# EAGLE schematic followLineSensor (EAGLE 7.7.0)
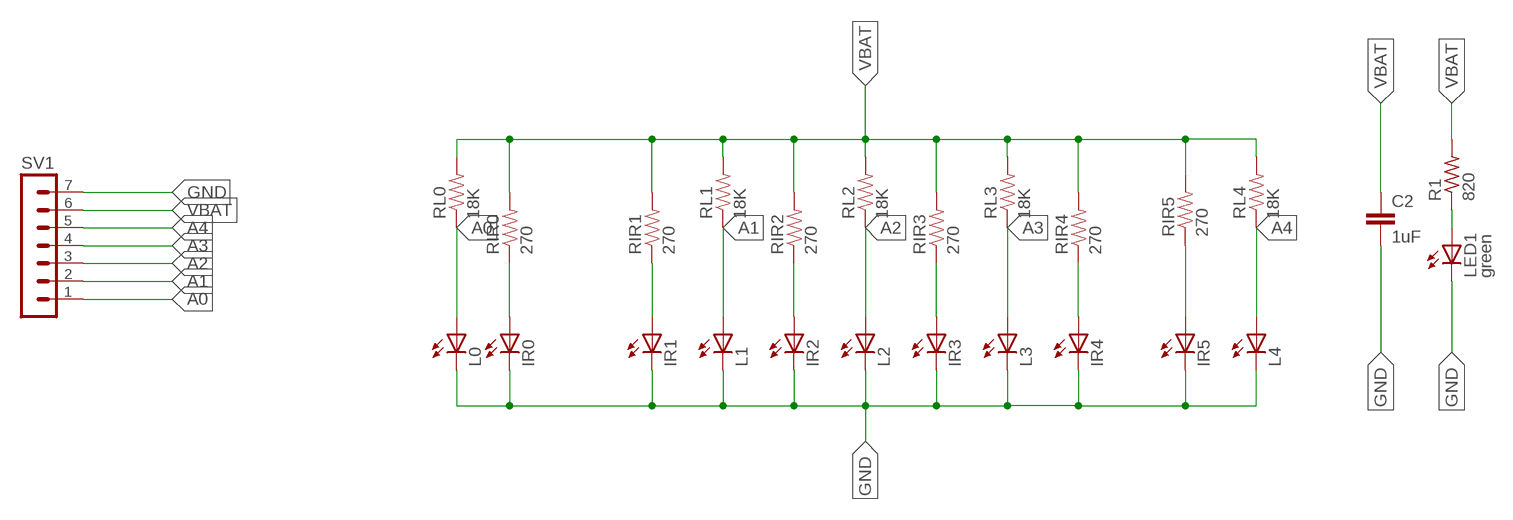
[diagram p0: schematic, sheet 1]

## Parts
C2  1uF  C-EUC1206  [C1206]
IR0  LED5MM  [LED5MM]
IR1  LED5MM  [LED5MM]
IR2  LED5MM  [LED5MM]
IR3  LED5MM  [LED5MM]
IR4  LED5MM  [LED5MM]
IR5  LED5MM  [LED5MM]
L0  LED5MM  [LED5MM]
L1  LED5MM  [LED5MM]
L2  LED5MM  [LED5MM]
L3  LED5MM  [LED5MM]
L4  LED5MM  [LED5MM]
LED1  green  LEDSML0805  [SML0805]
R1  820  R-US_R0805  [R0805]
RIR0  270  RESISTOR1206  [1206]
RIR1  270  RESISTOR1206  [1206]
RIR2  270  RESISTOR1206  [1206]
RIR3  270  RESISTOR1206  [1206]
RIR4  270  RESISTOR1206  [1206]
RIR5  270  RESISTOR1206  [1206]
RL0  18K  RESISTOR1206  [1206]
RL1  18K  RESISTOR1206  [1206]
RL2  18K  RESISTOR1206  [1206]
RL3  18K  RESISTOR1206  [1206]
RL4  18K  RESISTOR1206  [1206]
SV1  MA07-1  [MA07-1]

## Nets
A0: L0.A RL0.1 SV1.1
A1: L1.A RL1.1 SV1.2
A2: L2.A RL2.1 SV1.3
A3: L3.A RL3.1 SV1.4
A4: L4.A RL4.1 SV1.5
GND: C2.2 IR0.K(C) IR1.K(C) IR2.K(C) IR3.K(C) IR4.K(C) IR5.K(C) L0.K(C) L1.K(C) L2.K(C) L3.K(C) L4.K(C) LED1.C SV1.7
N$1: IR1.A RIR1.1
N$2: LED1.A R1.1
N$3: IR5.A RIR5.1
N$17: IR4.A RIR4.1
N$18: IR3.A RIR3.1
N$19: IR2.A RIR2.1
N$21: IR0.A RIR0.1
VBAT: C2.1 R1.2 RIR0.2 RIR1.2 RIR2.2 RIR3.2 RIR4.2 RIR5.2 RL0.2 RL1.2 RL2.2 RL3.2 RL4.2 SV1.6

## Library data of the parts
C2 = rcl:C-EU: CAPACITOR, European symbol
IR0 IR1-IR5 L0 L1-L4 LED1 = led:LED: LED OSRAM: - CHIPLED LG R971, LG N971, LY N971, LG Q971, LY Q971, LO R971, LY R971 LH N974, LH R974 LS Q976, LO Q976, LY Q976 LO Q996 - Hyper CHIPLED LW Q18S LB Q993, LB Q99A, LB R99A - SideLED LS A670, LO A670, LY A670, LG A670, LP A670 LB A673, LV A673, LT A673, LW A673 LH A674 LY A675 LS A676, LA A676, LO A676, LY A676, LW A676 LS A679, LY A679, LG A679 - Hyper Micro SIDELED® LS Y876, LA Y876, LO Y876, LY Y876 LT Y87S - SmartLED LW L88C, LW L88S LB L89C, LB L89S, LG L890 LS L89K, LO L89K, LY L89K LS L896, LA L896, LO L896, LY L896 - TOPLED LS T670, LO T670, LY T670, LG T670, LP T670 LSG T670, LSP T670, LSY T670, LOP T670, LYG T670 LG T671, LOG T671, LSG T671 LB T673, LV T673, LT T673, LW T673 LH T674 LS T676, LA T676, LO T676, LY T676, LB T676, LH T676, LSB T676, LW T676 LB T67C, LV T67C, LT T67C, LS T67K, LO T67K, LY T67K, LW E67C LS E67B, LA E67B, LO E67B, LY E67B, LB E67C, LV E67C, LT E67C LW T67C LS T679, LY T679, LG T679 LS T770, LO T770, LY T770, LG T770, LP T770 LB T773, LV T773, LT T773, LW T773 LH T774 LS E675, LA E675, LY E675, LS T675 LS T776, LA T776, LO T776, LY T776, LB T776 LHGB T686 LT T68C, LB T68C - Hyper Mini TOPLED® LB M676 - Mini TOPLED Santana® LG M470 LS M47K, LO M47K, LY M47K Source: http://www.osram.convergy.de LUXEON: - LUMILED® LXK2-PW12-R00, LXK2-PW12-S00, LXK2-PW14-U00, LXK2-PW14-V00 LXK2-PM12-R00, LXK2-PM12-S00, LXK2-PM14-U00 LXK2-PE12-Q00, LXK2-PE12-R00, LXK2-PE12-S00, LXK2-PE14-T00, LXK2-PE14-U00 LXK2-PB12-K00, LXK2-PB12-L00, LXK2-PB12-M00, LXK2-PB14-N00, LXK2-PB14-P00, LXK2-PB14-Q00 LXK2-PR12-L00, LXK2-PR12-M00, LXK2-PR14-Q00, LXK2-PR14-R00 LXK2-PD12-Q00, LXK2-PD12-R00, LXK2-PD12-S00 LXK2-PH12-R00, LXK2-PH12-S00 LXK2-PL12-P00, LXK2-PL12-Q00, LXK2-PL12-R00 Source: www.luxeon.com KINGBRIGHT: KA-3528ASYC Source: www.kingbright.com
R1 = rcl:R-US_: RESISTOR, American symbol
RIR0 RIR1-RIR5 RL0 RL1-RL4 = SparkFun-Passives:RESISTOR: Resistor Basic schematic elements and footprints for 0603, 1206, and PTH resistors.
SV1 = con-lstb:MA07-1: PIN HEADER; OC_FARNELL: unknown; OC_NEWARK: unknown